# EAGLE design moter (EAGLE 7.1.0)
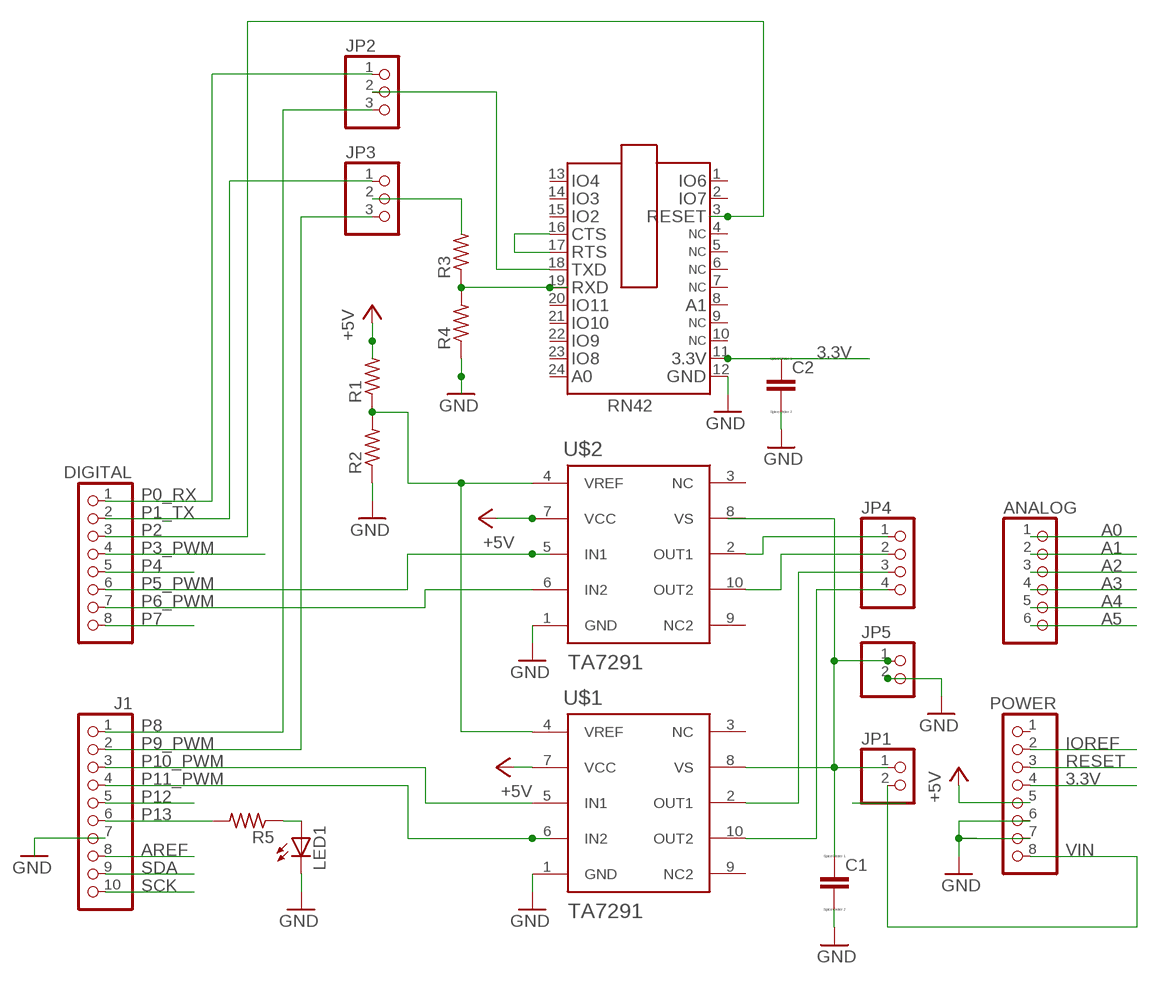
[diagram p0: schematic, sheet 1]

## Parts
ANALOG  PINHD-1X6  [1X06]
C1  C-EU050-025X075  [C050-025X075]
C2  C-EU050-025X075  [C050-025X075]
DIGITAL  PINHD-1X8TH  [1X08-TH]
IC1  RN42-9  [RN42-PKG]
J1  PINHD-1X10TH  [1X10-TH]
JP1  PINHD-1X2  [1X02]
JP2  PINHD-1X3  [1X03]
JP3  PINHD-1X3  [1X03]
JP4  PINHD-1X4  [1X04]
JP5  PINHD-1X2  [1X02]
LED1  LED3MM  [LED3MM]
POWER  PINHD-1X8TH  [1X08-TH]
R1  R-US_0207/10  [0207/10]
R2  R-US_0207/10  [0207/10]
R3  R-US_0207/10  [0207/10]
R4  R-US_0207/10  [0207/10]
R5  R-US_0207/10  [0207/10]
U$1  TA7291  [HSIP10]
U$2  TA7291  [HSIP10]

## Nets
3.3V: C2.1 IC1.11 POWER.4
+5V: POWER.5 R1.2 U$1.7(VCC) U$2.7(VCC)
A0: ANALOG.1
A1: ANALOG.2
A2: ANALOG.3
A3: ANALOG.4
A4: ANALOG.5
A5: ANALOG.6
AREF: J1.8
GND: C1.2 C2.2 IC1.12 J1.7 JP5.2 LED1.K(C) POWER.6 POWER.7 R2.1 R4.1 U$1.1(GND) U$2.1(GND)
IOREF: POWER.2
N$1: JP4.3 U$1.2(OUT1)
N$2: LED1.A R5.1
N$3: IC1.16 IC1.17
N$4: JP3.2 R3.2
N$5: IC1.18 JP2.2
N$6: IC1.19 R3.1 R4.2
N$8: R1.1 R2.2 U$1.4(VREF) U$2.4(VREF)
N$11: JP4.4 U$1.10(OUT2)
N$13: JP4.2 U$2.10(OUT2)
N$16: JP4.1 U$2.2(OUT1)
P0_RX: DIGITAL.1 JP2.1
P1_TX: DIGITAL.2 JP3.1
P2: DIGITAL.3 IC1.3
P3_PWM: DIGITAL.4
P4: DIGITAL.5
P5_PWM: DIGITAL.6 U$2.5(IN1)
P6_PWM: DIGITAL.7 U$2.6(IN2)
P7: DIGITAL.8
P8: J1.1 JP2.3
P9_PWM: J1.2 JP3.3
P10_PWM: J1.3 U$1.5(IN1)
P11_PWM: J1.4 U$1.6(IN2)
P12: J1.5
P13: J1.6 R5.2
RESET: POWER.3
SCK: J1.10
SDA: J1.9
VIN: JP1.2 POWER.8
VS: C1.1 JP1.1 JP5.1 U$1.8(VS) U$2.8(VS)
Unconnected: IC1.1 IC1.2 IC1.4 IC1.5 IC1.6 IC1.7 IC1.8 IC1.9 IC1.10 IC1.13 IC1.14 IC1.15 IC1.20 IC1.21 IC1.22 IC1.23 IC1.24 POWER.1 U$1.3(NC) U$1.9(NC2) U$2.3(NC) U$2.9(NC2)

## Library data of the parts
ANALOG = pinhead:PINHD-1X6: PIN HEADER
C1 C2 = resistor:C-EU: CAPACITOR, European symbol; SPICEPREFIX: C
DIGITAL POWER = SmartPrj:PINHD-1X8: PIN HEADER
IC1 = RN42:RN42: Dual In Line
J1 = SmartPrj:PINHD-1X10: PIN HEADER
JP1 JP5 = pinhead:PINHD-1X2: PIN HEADER
JP2 JP3 = pinhead:PINHD-1X3: PIN HEADER
JP4 = pinhead:PINHD-1X4: PIN HEADER
LED1 = led:LED: LED OSRAM: - CHIPLED LG R971, LG N971, LY N971, LG Q971, LY Q971, LO R971, LY R971 LH N974, LH R974 LS Q976, LO Q976, LY Q976 LO Q996 - Hyper CHIPLED LW Q18S LB Q993, LB Q99A, LB R99A - SideLED LS A670, LO A670, LY A670, LG A670, LP A670 LB A673, LV A673, LT A673, LW A673 LH A674 LY A675 LS A676, LA A676, LO A676, LY A676, LW A676 LS A679, LY A679, LG A679 - Hyper Micro SIDELED® LS Y876, LA Y876, LO Y876, LY Y876 LT Y87S - SmartLED LW L88C, LW L88S LB L89C, LB L89S, LG L890 LS L89K, LO L89K, LY L89K LS L896, LA L896, LO L896, LY L896 - TOPLED LS T670, LO T670, LY T670, LG T670, LP T670 LSG T670, LSP T670, LSY T670, LOP T670, LYG T670 LG T671, LOG T671, LSG T671 LB T673, LV T673, LT T673, LW T673 LH T674 LS T676, LA T676, LO T676, LY T676, LB T676, LH T676, LSB T676, LW T676 LB T67C, LV T67C, LT T67C, LS T67K, LO T67K, LY T67K, LW E67C LS E67B, LA E67B, LO E67B, LY E67B, LB E67C, LV E67C, LT E67C LW T67C LS T679, LY T679, LG T679 LS T770, LO T770, LY T770, LG T770, LP T770 LB T773, LV T773, LT T773, LW T773 LH T774 LS E675, LA E675, LY E675, LS T675 LS T776, LA T776, LO T776, LY T776, LB T776 LHGB T686 LT T68C, LB T68C - Hyper Mini TOPLED® LB M676 - Mini TOPLED Santana® LG M470 LS M47K, LO M47K, LY M47K Source: http://www.osram.convergy.de LUXEON: - LUMILED® LXK2-PW12-R00, LXK2-PW12-S00, LXK2-PW14-U00, LXK2-PW14-V00 LXK2-PM12-R00, LXK2-PM12-S00, LXK2-PM14-U00 LXK2-PE12-Q00, LXK2-PE12-R00, LXK2-PE12-S00, LXK2-PE14-T00, LXK2-PE14-U00 LXK2-PB12-K00, LXK2-PB12-L00, LXK2-PB12-M00, LXK2-PB14-N00, LXK2-PB14-P00, LXK2-PB14-Q00 LXK2-PR12-L00, LXK2-PR12-M00, LXK2-PR14-Q00, LXK2-PR14-R00 LXK2-PD12-Q00, LXK2-PD12-R00, LXK2-PD12-S00 LXK2-PH12-R00, LXK2-PH12-S00 LXK2-PL12-P00, LXK2-PL12-Q00, LXK2-PL12-R00 Source: www.luxeon.com KINGBRIGHT: KA-3528ASYC Source: www.kingbright.com
R1-R5 = resistor:R-US_: RESISTOR, American symbol
U$1 U$2 = TA7291P:TA7291

## Board
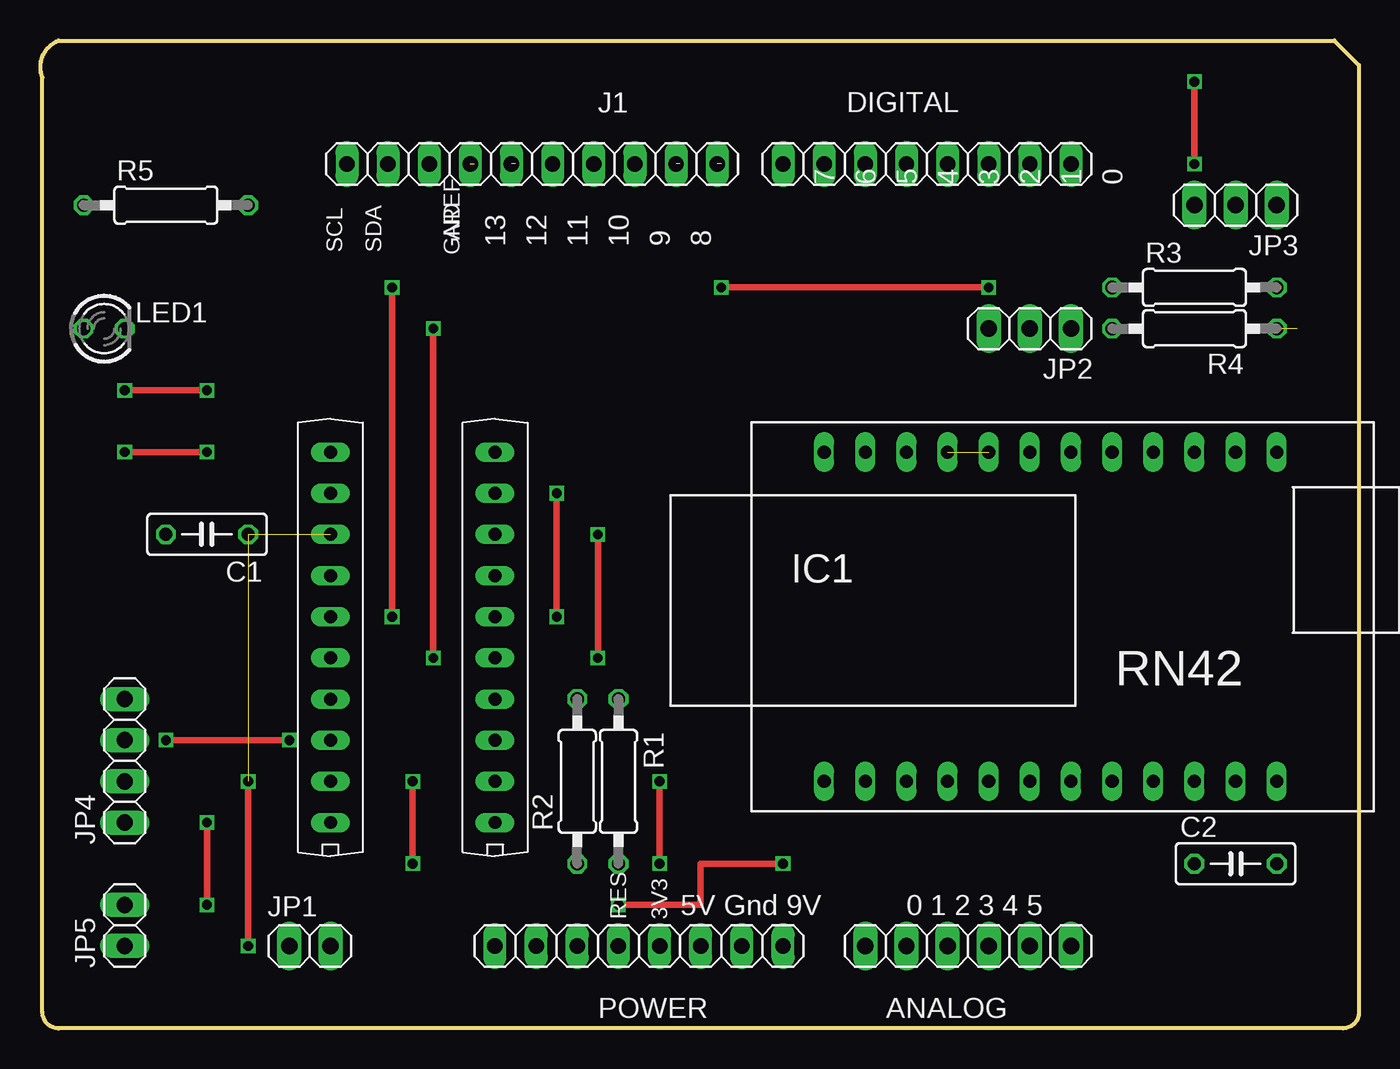
[diagram p1: board, top side]
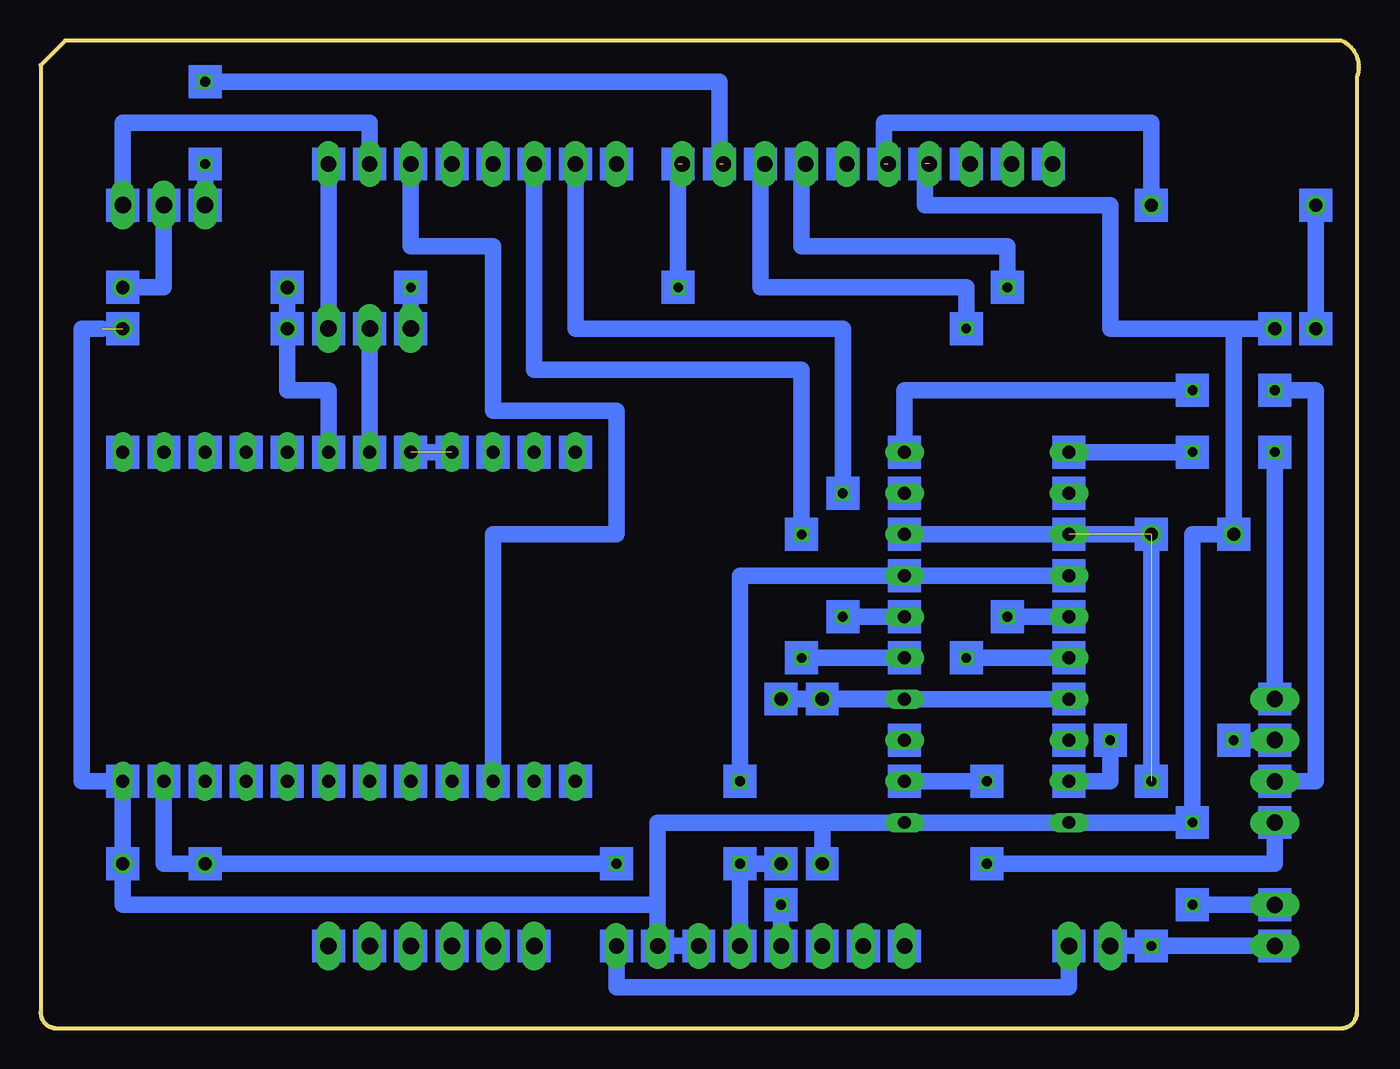
[diagram p2: board, bottom side, seen from below]

Size 81.4 x 60.96 mm. Coordinates in mm from the lower left corner, seen from the top.
Outline: 79.87,60.96 81.4,59.44 81.4,1 arc-90 80.4,0 1.12,0 arc-90 0.12,1 0.12,58.69 arc-90 1.12,60.96 79.87,60.96
Copper layers (1*16): Top 0.035mm / dielectric 1.53mm / Bottom 0.035mm
Design rules "pban_4mil-l2": minimum track width 0.1mm, minimum drill 0.3mm, track to track 0.1mm, track to pad 0.229mm, pad to pad 0.1mm, via to via 0.1mm, smd to smd 0.1mm, copper to edge 0.5mm, drill to drill 0.5mm, minimum pad ring 0.15mm, minimum via ring 0.15mm, stop-mask expansion 4mil, vias tented up to drill 0.35mm, thermal gap 10mil

### Footprints (pad centres in the part's own frame; a part is rotated, then mirrored left to right if it is on the bottom)
1X06 = drill 1.016 long: 1 -6.35,0; 2 -3.81,0; 3 -1.27,0; 4 1.27,0; 5 3.81,0; 6 6.35,0
C050-025X075 = drill 0.813 octagon: 1 -2.54,0; 2 2.54,0
1X08-TH = drill 0.95 pad 1.422 long: 1 -8.89,0; 2 -6.35,0; 3 -3.81,0; 4 -1.27,0; 5 1.27,0; 6 3.81,0; 7 6.35,0; 8 8.89,0
RN42-PKG = drill 0.813 long: 1 -13.97,-10.16; 2 -11.43,-10.16; 3 -8.89,-10.16; 4 -6.35,-10.16; 5 -3.81,-10.16; 6 -1.27,-10.16; 7 1.27,-10.16; 8 3.81,-10.16; 9 6.35,-10.16; 10 8.89,-10.16; 11 11.43,-10.16; 12 13.97,-10.16; 13 -13.97,10.16; 14 -11.43,10.16; 15 -8.89,10.16; 16 -6.35,10.16; 17 -3.81,10.16; 18 -1.27,10.16; 19 1.27,10.16; 20 3.81,10.16; 21 6.35,10.16; 22 8.89,10.16; 23 11.43,10.16; 24 13.97,10.16
1X10-TH = drill 0.95 pad 1.422 long: 1 -11.43,0; 2 -8.89,0; 3 -6.35,0; 4 -3.81,0; 5 -1.27,0; 6 1.27,0; 7 3.81,0; 8 6.35,0; 9 8.89,0; 10 11.43,0
1X02 = drill 1.016 long: 1 -1.27,0; 2 1.27,0
1X03 = drill 1.016 long: 1 -2.54,0; 2 0,0; 3 2.54,0
1X04 = drill 1.016 long: 1 -3.81,0; 2 -1.27,0; 3 1.27,0; 4 3.81,0
LED3MM = drill 0.813 octagon: A -1.27,0; K 1.27,0
0207/10 = drill 0.813 octagon: 1 -5.08,0; 2 5.08,0
HSIP10 = drill 0.8 long: 1 -11.43,0; 2 -8.89,0; 3 -6.35,0; 4 -3.81,0; 5 -1.27,0; 6 1.27,0; 7 3.81,0; 8 6.35,0; 9 8.89,0; 10 11.43,0

### Placement (x,y rotation side)
ANALOG  57.27,5.08 0 top
C1  10.28,30.48 180 top
C2  73.78,10.16 0 top
DIGITAL  54.73,53.34 180 top
IC1  62.35,25.4 0 top
J1  30.34,53.34 180 top
JP1  16.63,5.08 0 top
JP2  61.08,43.18 180 top
JP3  73.78,50.8 180 top
JP4  5.2,16.51 90 top
JP5  5.2,6.35 90 top
LED1  3.93,43.18 0 top
POWER  36.95,5.08 0 top
R1  35.68,15.24 270 top
R2  33.14,15.24 90 top
R3  71.24,45.72 0 top
R4  71.24,43.18 180 top
R5  7.74,50.8 0 top
U$1  17.9,24.13 90 top
U$2  28.06,24.13 90 top

### Tracks (layer width: path | path; a pad name or v marks a point on that pad's centre or on a via)
3.3V  (via drill 0.6)
  Top 0.406: v45.84,10.16 40.76,10.16 40.76,7.62 v35.68,7.62
  Bottom 1.016: IC1.11 73.78,10.16 C2.1 v45.84,10.16 | v35.68,7.62 POWER.4
+5V  (via drill 0.6)
  Top 0.1: 38.22,5.14 POWER.5
  Top 0.406: v38.22,15.24 v38.22,10.16
  Bottom 1.016: U$1.7 U$2.7 38.22,27.94 v38.22,15.24 | POWER.5 v38.22,10.16 R1.2
GND  (via drill 0.6)  (2 unrouted)
  Top 0.406: v10.28,7.62 v10.28,12.7
  Bottom 1.016: 33.14,12.7 U$2.1 U$1.1 v10.28,12.7 10.28,30.48 C1.2 7.74,43.18 | 33.14,12.7 R2.1 | 43.3,7.62 76.32,7.62 C2.2 IC1.12 78.86,15.24 78.86,43.18 77.59,43.18 | 43.3,7.62 POWER.7 POWER.6 | 33.14,12.7 43.3,12.7 43.3,7.62 | 26.79,53.34 26.79,50.8 15.36,50.8 15.36,43.18 7.74,43.18 | 7.74,43.18 LED1.K | JP5.2 v10.28,7.62
N$1  (via drill 0.6)
  Top 0.406: v7.74,17.78 v15.36,17.78
  Bottom 1.016: v15.36,17.78 15.36,15.24 U$1.2 | v7.74,17.78 JP4.3
N$2
  Bottom 1.016: R5.1 LED1.A
N$3  (1 unrouted)
  Bottom 1.016: IC1.16 IC1.17
N$4
  Bottom 1.016: JP3.2 73.78,45.72 R3.2
N$5
  Bottom 1.016: JP2.2 IC1.18
N$6
  Bottom 1.016: IC1.19 63.62,39.37 66.16,39.37 R4.2 R3.1
N$8
  Bottom 1.016: R2.2 35.6,20.34 28.1,20.34 U$2.4 | U$1.4 U$2.4 | U$2.4 R2.2 | R2.2 R1.1
N$11  (via drill 0.6)
  Top 0.406: v5.2,35.56 v10.28,35.56
  Bottom 1.016: v10.28,35.56 U$1.10 | v5.2,35.56 JP4.4
N$13  (via drill 0.6)
  Top 0.406: v10.28,39.37 v5.2,39.37
  Bottom 1.016: U$2.10 28.06,39.37 v10.28,39.37 | v5.2,39.37 2.66,39.37 2.66,15.24 JP4.2
N$16  (via drill 0.6)
  Top 0.406: v22.98,15.24 v22.98,10.16
  Bottom 1.016: U$2.2 v22.98,15.24 | v22.98,10.16 5.2,10.16 JP4.1
P0_RX
  Bottom 1.016: DIGITAL.1 JP2.1
P1_TX
  Bottom 1.016: 61.12,53.34 DIGITAL.2 61.08,55.88 76.32,55.88 JP3.1
P2
  Bottom 1.016: DIGITAL.3 58.54,48.26 53.46,48.26 53.46,38.1 45.84,38.1 45.84,30.48 53.46,30.48 IC1.3
P5_PWM  (via drill 0.6)
  Top 0.406: v34.41,22.86 v34.41,30.48
  Bottom 1.016: v34.41,30.48 34.41,40.64 50.92,40.64 DIGITAL.6 | U$2.5 v34.41,22.86
P6_PWM  (via drill 0.6)
  Top 0.406: v31.87,33.02 v31.87,25.4
  Bottom 1.016: v31.87,33.02 31.87,36.83 31.87,39.37 31.87,43.18 48.38,43.18 DIGITAL.7 | U$2.6 v31.87,25.4
P8  (via drill 0.6)  (1 unrouted)
  Top 0.406: v42.03,45.72 v58.54,45.72
  Bottom 1.016: 42.03,53.34 v42.03,45.72 | v58.54,45.72 JP2.3
P9_PWM  (via drill 0.6)  (1 unrouted)
  Top 0.406: v71.24,58.42 v71.24,53.34
  Bottom 1.016: 39.49,53.34 39.49,58.42 v71.24,58.42 | v71.24,53.34 JP3.3
P10_PWM  (via drill 0.6)
  Top 0.406: v24.25,22.86 v24.25,43.18
  Bottom 1.016: U$1.5 v24.25,22.86 | v24.25,43.18 24.25,45.72 36.95,45.72 36.95,53.34 J1.3
P11_PWM  (via drill 0.6)
  Top 0.406: v21.71,25.4 v21.71,45.72
  Bottom 1.016: U$1.6 v21.71,25.4 | v21.71,45.72 21.71,48.26 34.41,48.26 34.41,53.34 J1.4
P13  (1 unrouted)
  Bottom 1.016: R5.2 12.82,55.88 29.33,55.88 29.33,53.34
VIN
  Bottom 1.016: JP1.2 17.9,2.54 45.84,2.54 POWER.8
VS  (via drill 0.6)  (3 unrouted)
  Top 0.406: v12.82,15.24 v12.82,5.08
  Bottom 1.016: U$2.8 U$1.8 C1.1 v12.82,15.24 | JP5.1 v12.82,5.08 JP1.1
(copper drawn outside any net)
  shapes: Bottom area x132

### Text on the board
tPlace: 7 | 6 | 5 | 4 | 3 | 2 | 1 | 0 | 13 | 12 | 11 | 10 | 9 | 8
tNames: AREF | SCL | SDA | GND | RES | 3V3 | 5V Gnd 9V | 0 1 2 3 4 5
bStop: 7 | 6 | 5 | 4 | 3 | 2 | 1 | 0 | 12 | 10 | SCL | AREF | GND | 9 | 8 | SDA | IOREF | RST | 3.3V | 5V | GND | GND | 0 | 1 | 2 | 3 | 4 | 5 | VIN